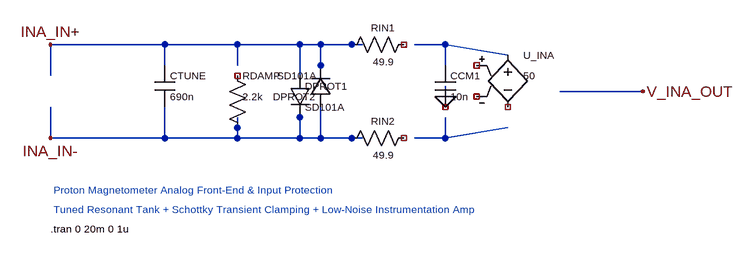
[diagram p0: schematic measuring_circuit_graphical.asc]
measuring_circuit_graphical.asc, the LTspice schematic file:
Version 4
SHEET 1 1200 680
WIRE 128 96 48 96
WIRE 48 96 48 144
WIRE 48 192 48 240
WIRE 48 240 128 240
WIRE 224 96 128 96
WIRE 336 96 224 96
WIRE 448 96 336 96
WIRE 528 96 448 96
WIRE 224 240 128 240
WIRE 336 240 224 240
WIRE 448 240 336 240
WIRE 528 240 448 240
WIRE 224 128 224 96
WIRE 224 240 224 192
WIRE 336 128 336 96
WIRE 336 240 336 208
WIRE 432 96 432 144
WIRE 432 240 432 192
WIRE 464 96 464 144
WIRE 464 240 464 192
WIRE 656 96 608 96
WIRE 656 240 608 240
WIRE 656 128 656 96
WIRE 656 208 656 240
WIRE 656 160 656 176
WIRE 752 112 656 96
WIRE 752 224 656 240
WIRE 912 168 832 168
WIRE 912 168 960 168
FLAG 656 176 0
FLAG 48 96 INA_IN+
FLAG 48 240 INA_IN-
FLAG 960 168 V_INA_OUT
SYMBOL cap 208 128 R0
WINDOW 0 24 16 Left 1
WINDOW 3 24 48 Left 1
SYMATTR InstName CTUNE
SYMATTR Value 690n
SYMBOL res 320 128 R0
WINDOW 0 24 16 Left 1
WINDOW 3 24 48 Left 1
SYMATTR InstName RDAMP
SYMATTR Value 2.2k
SYMBOL diode 416 144 R0
WINDOW 0 24 16 Left 1
WINDOW 3 24 48 Left 1
SYMATTR InstName DPROT1
SYMATTR Value SD101A
SYMBOL diode 480 192 R180
WINDOW 0 24 16 Left 1
WINDOW 3 24 48 Left 1
SYMATTR InstName DPROT2
SYMATTR Value SD101A
SYMBOL res 608 80 R90
WINDOW 0 0 48 VBottom 1
WINDOW 3 32 48 VTop 1
SYMATTR InstName RIN1
SYMATTR Value 49.9
SYMBOL res 608 224 R90
WINDOW 0 0 48 VBottom 1
WINDOW 3 32 48 VTop 1
SYMATTR InstName RIN2
SYMATTR Value 49.9
SYMBOL cap 640 128 R0
WINDOW 0 24 16 Left 1
WINDOW 3 24 48 Left 1
SYMATTR InstName CCM1
SYMATTR Value 10n
SYMBOL e 752 96 R0
WINDOW 0 24 16 Left 1
WINDOW 3 24 48 Left 1
SYMATTR InstName U_INA
SYMATTR Value 50
SYMATTR Value2 INA828
TEXT 48 320 Left 1 ; Proton Magnetometer Analog Front-End & Input Protection
TEXT 48 350 Left 1 ; Tuned Resonant Tank + Schottky Transient Clamping + Low-Noise Instrumentation Amp
TEXT 48 380 Left 1 !.tran 0 20m 0 1u

The netlist it stands for:
* measuring_circuit_graphical.asc
CTUNE INA_IN+ INA_IN- 690n
RDAMP NC_01 INA_IN- 2.2k
DPROT1 INA_IN+ INA_IN- SD101A
DPROT2 INA_IN- INA_IN+ SD101A
RIN1 NC_02 INA_IN+ 49.9
RIN2 NC_03 INA_IN- 49.9
CCM1 N001 NC_04 10n
E§U_INA N001 NC_05 NC_06 NC_07 50 INA828
.model D D
.lib standard.dio
*  Proton Magnetometer Analog Front-End & Input Protection
*  Tuned Resonant Tank + Schottky Transient Clamping + Low-Noise Instrumentation Amp
.tran 0 20m 0 1u
.backanno
.end